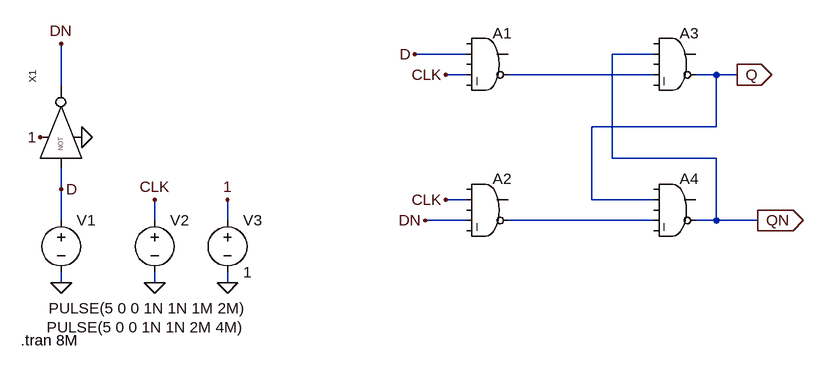
[diagram p0: schematic D_FLIPFLOP_GATE.asc]
D_FLIPFLOP_GATE.asc, the LTspice schematic file:
Version 4
SHEET 1 1120 680
WIRE 576 -128 496 -128
WIRE 864 -128 800 -128
WIRE 576 -96 544 -96
WIRE 864 -96 640 -96
WIRE 960 -96 928 -96
WIRE 992 -96 960 -96
WIRE -48 -80 -48 -144
WIRE 960 -16 960 -96
WIRE 960 -16 768 -16
WIRE 800 32 800 -128
WIRE 960 32 800 32
WIRE -48 80 -48 48
WIRE 576 96 544 96
WIRE 768 96 768 -16
WIRE 864 96 768 96
WIRE -48 128 -48 80
WIRE 96 128 96 96
WIRE 208 128 208 96
WIRE 576 128 512 128
WIRE 864 128 640 128
WIRE 960 128 960 32
WIRE 960 128 928 128
WIRE 1024 128 960 128
WIRE -48 224 -48 208
WIRE 96 224 96 208
WIRE 208 224 208 208
FLAG 208 96 1
FLAG 96 96 CLK
FLAG -48 -144 DN
FLAG -80 0 1
FLAG -48 80 D
FLAG -16 0 0
FLAG 96 224 0
FLAG 208 224 0
FLAG -48 224 0
FLAG 992 -96 Q
IOPIN 992 -96 Out
FLAG 1024 128 QN
IOPIN 1024 128 Out
FLAG 496 -128 D
FLAG 512 128 DN
FLAG 544 96 CLK
FLAG 544 -96 CLK
SYMBOL NOT4 -32 -16 R270
SYMATTR InstName X1
SYMBOL voltage -48 112 R0
WINDOW 3 -19 151 Left 2
WINDOW 123 0 0 Left 0
WINDOW 39 0 0 Left 0
SYMATTR InstName V1
SYMATTR Value PULSE(5 0 0 1N 1N 1M 2M)
SYMBOL voltage 96 112 R0
WINDOW 3 -166 180 Left 2
WINDOW 123 0 0 Left 0
WINDOW 39 0 0 Left 0
SYMATTR InstName V2
SYMATTR Value PULSE(5 0 0 1N 1N 2M 4M)
SYMBOL voltage 208 112 R0
WINDOW 123 0 0 Left 0
WINDOW 39 0 0 Left 0
SYMATTR InstName V3
SYMATTR Value 1
SYMBOL Digital\\and 608 -176 R0
SYMATTR InstName A1
SYMBOL Digital\\and 608 48 R0
SYMATTR InstName A2
SYMBOL Digital\\and 896 -176 R0
SYMATTR InstName A3
SYMBOL Digital\\and 896 48 R0
SYMATTR InstName A4
TEXT -110 312 Left 2 !.tran 8M

The netlist it stands for:
* D_FLIPFLOP_GATE.asc
XX1 D 1 0 DN NOT4  ; pins A VH VL OUT
V1 D 0 PULSE(5 0 0 1N 1N 1M 2M)
V2 CLK 0 PULSE(5 0 0 1N 1N 2M 4M)
V3 1 0 1
A1 0 D 0 CLK 0 N001 0 0 AND
A2 0 CLK 0 DN 0 N002 0 0 AND
A3 0 QN 0 N001 0 Q 0 0 AND
A4 0 Q 0 N002 0 QN 0 0 AND
.tran 8M
.backanno
.end

* Results of the author's LTspice run, read from the files saved beside the schematic
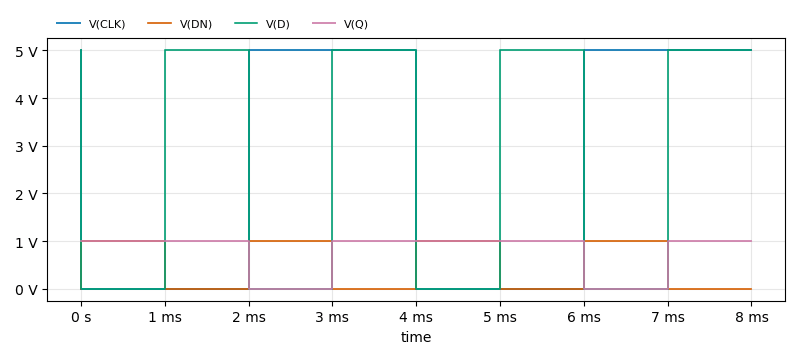
[diagram p1: Transient Analysis of D_FLIPFLOP_GATE.asc, plotted from the saved traces]
* Transient Analysis, 1 run:
*   V(CLK): min 0 V, max 5 V, average 2.5 V, rms 3.536 V, last 5 V
*   V(DN): min -784.4 nV, max 1 V, average 500 mV, rms 707.1 mV, last 0 V
*   V(D): min 0 V, max 5 V, average 2.5 V, rms 3.536 V, last 5 V
*   V(Q): min 0 V, max 1 V, average 750 mV, rms 866 mV, last 1 V